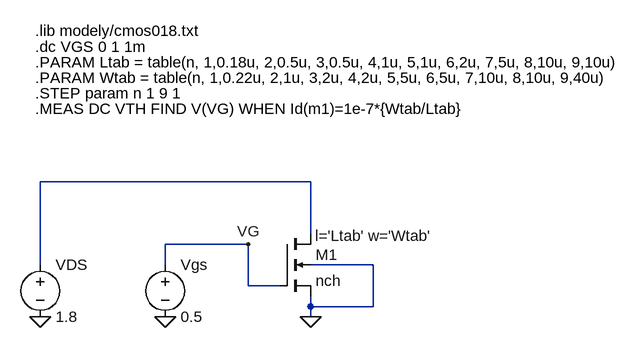
[diagram p0: schematic N21-mos.asc]
N21-mos.asc, the LTspice schematic file:
Version 4.1
SHEET 1 880 680
WIRE 224 64 -192 64
WIRE 224 144 224 64
WIRE 128 160 0 160
WIRE -192 192 -192 64
WIRE 0 192 0 160
WIRE 320 192 224 192
WIRE 128 224 128 160
WIRE 176 224 128 224
WIRE 224 256 224 240
WIRE 320 256 320 192
WIRE 320 256 224 256
WIRE 224 272 224 256
FLAG 224 272 0
FLAG -192 272 0
FLAG 0 272 0
FLAG 128 160 VG
SYMBOL nmos4 176 144 R0
WINDOW 123 55 3 Left 2
SYMATTR Value2 l='Ltab' w='Wtab'
SYMATTR InstName M1
SYMATTR Value nch
SYMBOL voltage 0 176 R0
WINDOW 123 0 0 Left 0
WINDOW 39 0 0 Left 0
SYMATTR InstName Vgs
SYMATTR Value 0.5
SYMBOL voltage -192 176 R0
WINDOW 123 0 0 Left 0
WINDOW 39 0 0 Left 0
SYMATTR InstName VDS
SYMATTR Value 1.8
TEXT -200 -168 Left 2 !.lib modely/cmos018.txt
TEXT -200 -120 Left 2 !.PARAM Ltab = table(n, 1,0.18u, 2,0.5u, 3,0.5u, 4,1u, 5,1u, 6,2u, 7,5u, 8,10u, 9,10u)
TEXT -200 -96 Left 2 !.PARAM Wtab = table(n, 1,0.22u, 2,1u, 3,2u, 4,2u, 5,5u, 6,5u, 7,10u, 8,10u, 9,40u)
TEXT -200 -72 Left 2 !.STEP param n 1 9 1
TEXT -200 -48 Left 2 !.MEAS DC VTH FIND V(VG) WHEN Id(m1)=1e-7*{Wtab/Ltab}
TEXT -200 -144 Left 2 !.dc VGS 0 1 1m

The netlist it stands for:
* N21-mos.asc
M1 N001 VG 0 0 nch l='Ltab' w='Wtab'
Vgs VG 0 0.5
VDS N001 0 1.8
.model NMOS NMOS
.model PMOS PMOS
.lib standard.mos
.lib modely/cmos018.txt
.PARAM Ltab = table(n, 1,0.18u, 2,0.5u, 3,0.5u, 4,1u, 5,1u, 6,2u, 7,5u, 8,10u, 9,10u)
.PARAM Wtab = table(n, 1,0.22u, 2,1u, 3,2u, 4,2u, 5,5u, 6,5u, 7,10u, 8,10u, 9,40u)
.STEP param n 1 9 1
.MEAS DC VTH FIND V(VG) WHEN Id(m1)=1e-7*{Wtab/Ltab}
.dc VGS 0 1 1m
.backanno
.end